# Altium project PCB_Project_Mini mobile robot.PrjPcb
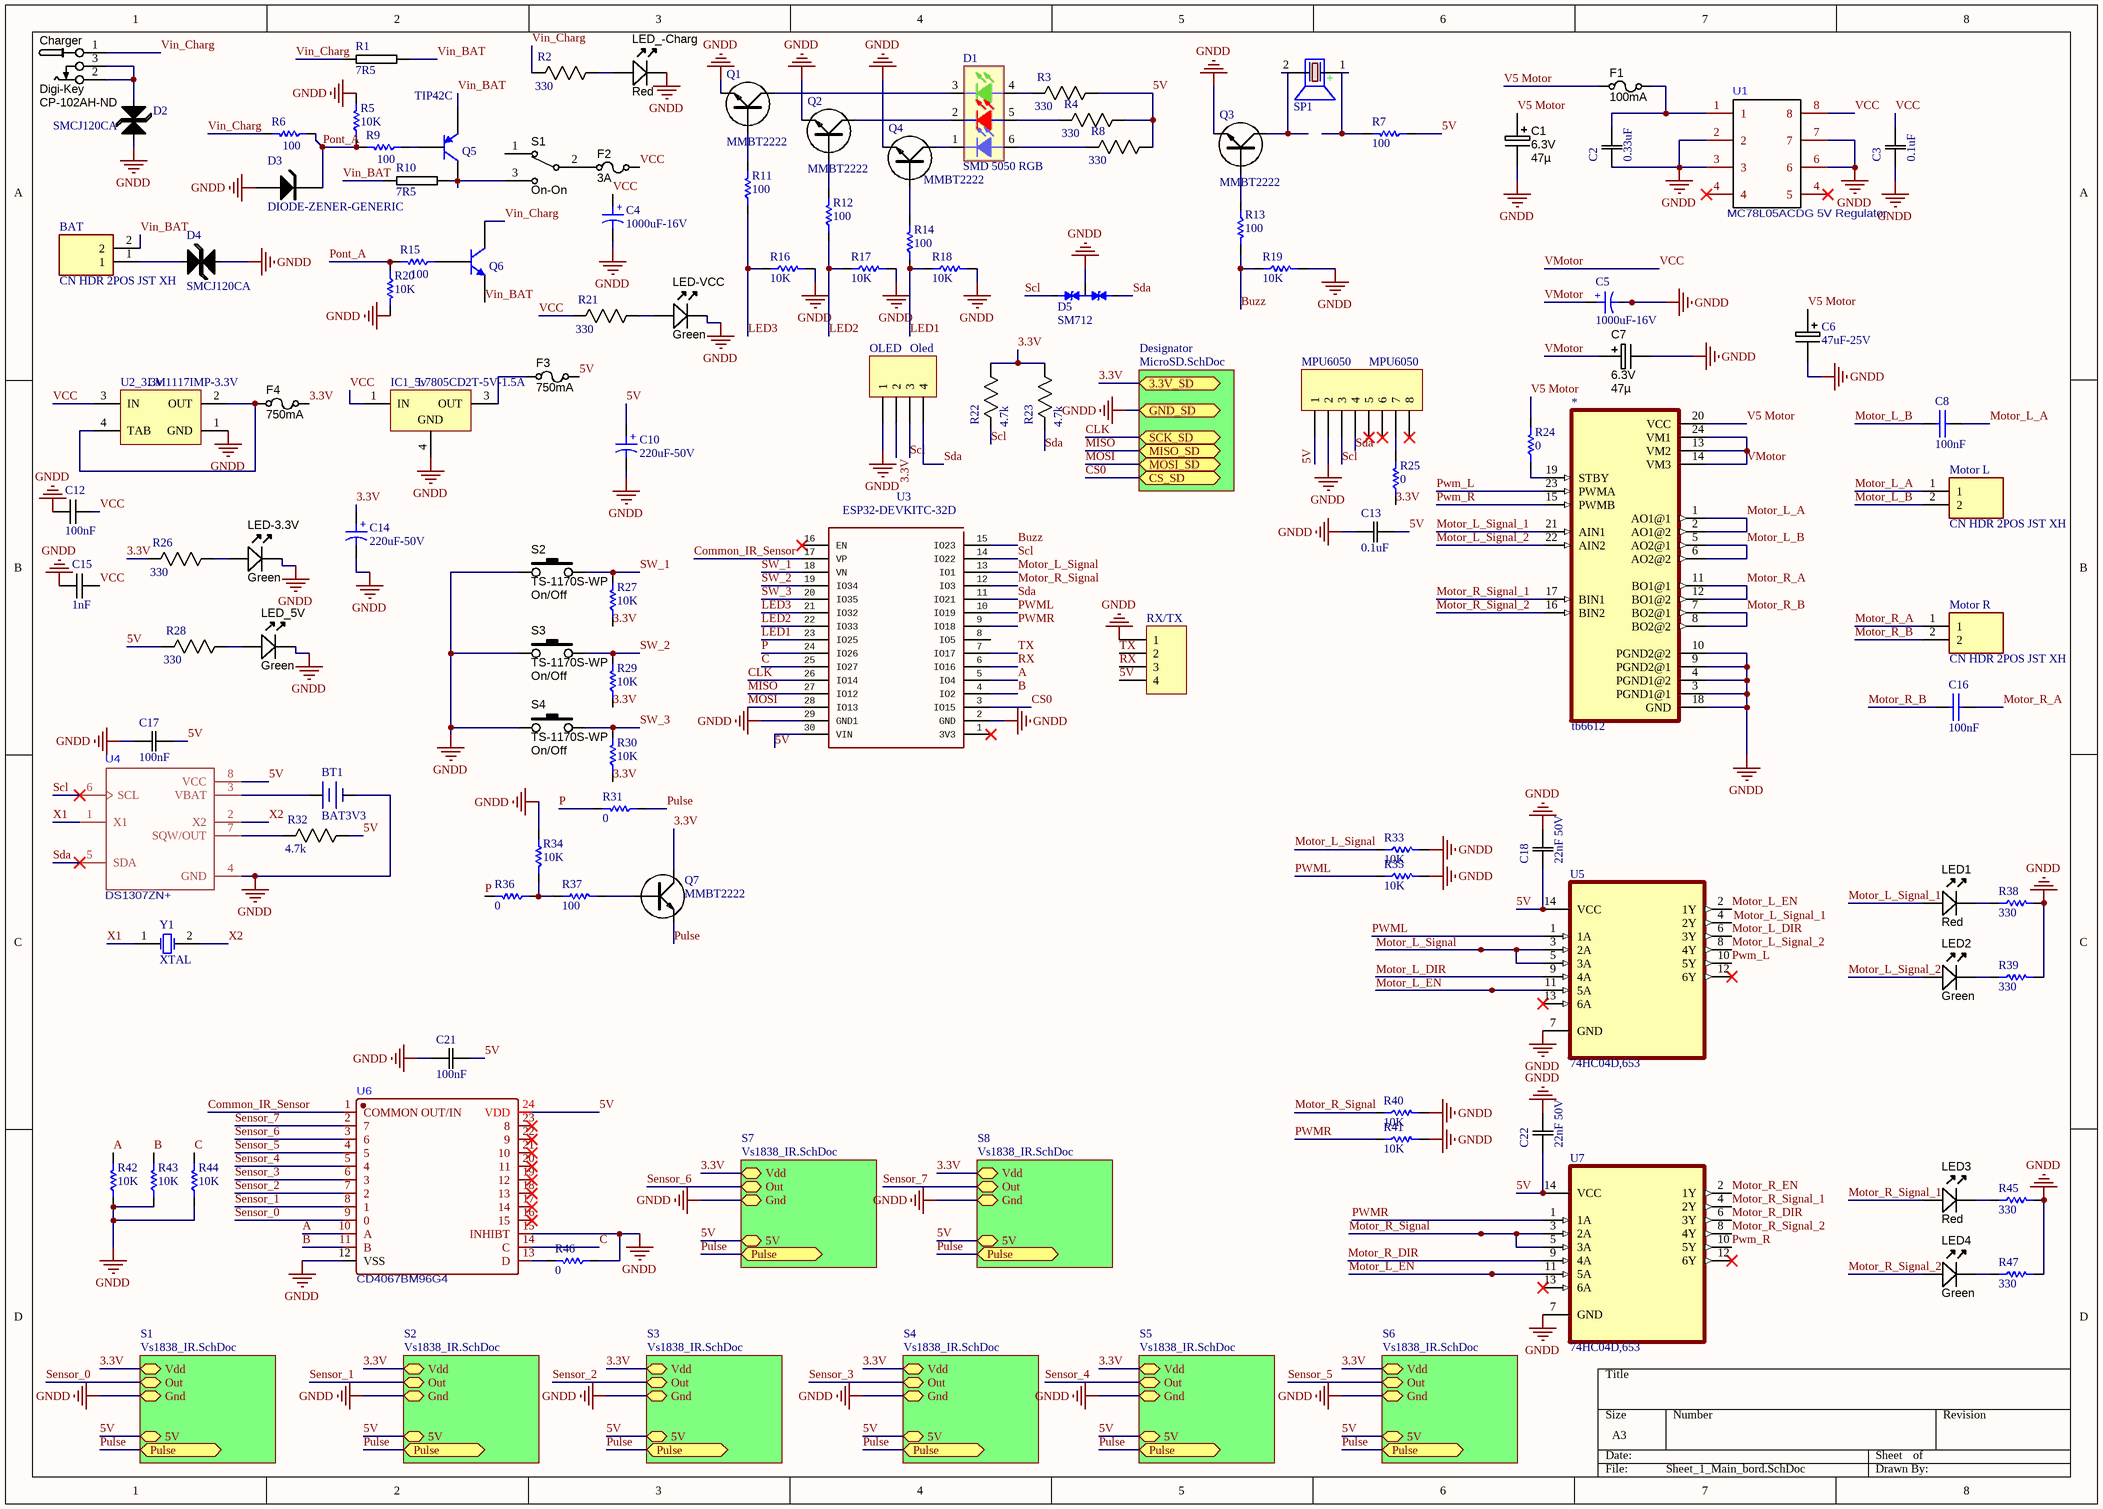
[diagram p0: Sheet_1_Main_bord.SchDoc]
3 sheets, 186 parts. Net scope: hierarchical (ports join the sheet entries above them; power ports are global).
Board file: Swarm.PcbDoc
Sheets:
  Sheet_1_Main_bord.SchDoc
    S1 = Vs1838_IR.SchDoc
    Designator = MicroSD.SchDoc
    S2 = Vs1838_IR.SchDoc
    S3 = Vs1838_IR.SchDoc
    S4 = Vs1838_IR.SchDoc
    S5 = Vs1838_IR.SchDoc
    S6 = Vs1838_IR.SchDoc
    S7 = Vs1838_IR.SchDoc
    S8 = Vs1838_IR.SchDoc

## Sheet Sheet_1_Main_bord.SchDoc
size A3; SheetNumber: 1; SheetTotal: 1

### Parts
*  tb6612  [Ssop24_SOP65P760X160-24N]
BAT  CN HDR 2POS JST XH  [JST_B2B-XH-A(LF)(SN)]
BT1  BAT3V3  [BTH1220]
C1  Ratings: 6.3V  [CAPMP3528X210N]  (hidden comment: 47µ)
C2  0.33uF  [0805]
C3  0.1uF  [0805]
C4  1000uF-16V  [CAP SMD 1000UF 16V]
C5  1000uF-16V  [CAP SMD 1000UF 16V]
C6  47uF-25V  [PANACAP-D-GENERIC]
C7  Ratings: 6.3V  [CAPMP3528X210N]  (hidden comment: 47µ)
C8  100nF  [Cap - 100nF - 2]
C10  220uF-50V  [CAP SMD 1000UF 16V]
C12  100nF  [1206C-GENERIC]
C13  0.1uF  [0805]
C14  220uF-50V  [CAP SMD 1000UF 16V]
C15  1nF  [1206C-GENERIC]
C16  100nF  [Cap - 100nF - 2]
C17  100nF  [0805]
C18  22nF 50V  [0805]
C21  100nF  [0805]
C22  22nF 50V  [0805]
Charger  Supplier 1: Digi-Key  Supplier Part Number 1: CP-102AH-ND  [CONN_PWR_JACK_2.1x5.5mm]  (hidden comment: CONN_PWR_JACK_2.1x5.5mm)
D1  Comment_1: SMD 5050 RGB  [5050 LED package]  (hidden comment: probably led colors not mach to real please check the device and change the component)
D2  SMCJ120CA  [DIODE-SMC]
D3  DIODE-ZENER-GENERIC  [SOT23-DIODE]
D4  SMCJ120CA  [DIODE-SMC]
D5  SM712  [PSM12___SOT23]
F1  value 100mA  [RESC3216X70N]  (hidden comment: Slow-blow)
F2  value 3A  [RESC3216X70N]  (hidden comment: Slow-blow)
F3  value 750mA  [RESC3216X70N]  (hidden comment: Slow-blow)
F4  value 750mA  [RESC3216X70N]  (hidden comment: Slow-blow)
IC1_5v  L7805CD2T-5V-1.5A  [TO-252]
LED1  Color: Red  [LED-0805-K]
LED2  Color: Green  [LED-0805-K]
LED3  Color: Red  [LED-0805-K]
LED4  Color: Green  [LED-0805-K]
LED-3.3V  Color: Green  [LED-0805-K]
LED-VCC  Color: Green  [LED-0805-K]
LED_5V  Color: Green  [LED-0805-K]
LED_-Charg  Color: Red  [LED-0805-K]
Motor_L  CN HDR 2POS JST XH  [JST_B2B-XH-A(LF)(SN)]
Motor_R  CN HDR 2POS JST XH  [JST_B2B-XH-A(LF)(SN)]
MPU6050  MPU6050  [HDR1X8]
OLED  Oled  [HDR1X4]
Q1  MMBT2222  [SOT23-BCE]
Q2  MMBT2222  [SOT23-BCE]
Q3  MMBT2222  [SOT23-BCE]
Q4  MMBT2222  [SOT23-BCE]
Q5  TIP42C  [TO-220 AB]
Q6  TIP41C  [TO-220 AB]  (value not drawn)
Q7  MMBT2222  [SOT23-BCE]
R1  7R5  [2512R-GENERIC]
R2  330  [0805]
R3  330  [0805]
R4  330  [0805]
R5  10K  [RES 0805 (2012X06L)]
R6  100  [RES 0805 (2012X06L)]
R7  100  [RES 0805 (2012X06L)]
R8  330  [0805]
R9  100  [RES 0805 (2012X06L)]
R10  7R5  [2512R-GENERIC]
R11  100  [RES 0805 (2012X06L)]
R12  100  [RES 0805 (2012X06L)]
R13  100  [RES 0805 (2012X06L)]
R14  100  [RES 0805 (2012X06L)]
R15  100  [RES 0805 (2012X06L)]
R16  10K  [RES 0805 (2012X06L)]
R17  10K  [RES 0805 (2012X06L)]
R18  10K  [RES 0805 (2012X06L)]
R19  10K  [RES 0805 (2012X06L)]
R20  10K  [RES 0805 (2012X06L)]
R21  330  [0805]
R22  4.7k  [0805]
R23  4.7k  [0805]
R24  0  [SMD_RES_0805]
R25  0  [SMD_RES_0805]
R26  330  [0805]
R27  10K  [RES 0805 (2012X06L)]
R28  330  [0805]
R29  10K  [RES 0805 (2012X06L)]
R30  10K  [RES 0805 (2012X06L)]
R31  0  [RES 0805 (2012X06L)]
R32  4.7k  [0805]
R33  10K  [RES 0805 (2012X06L)]
R34  10K  [RES 0805 (2012X06L)]
R35  10K  [RES 0805 (2012X06L)]
R36  0  [RES 0805 (2012X06L)]
R37  100  [RES 0805 (2012X06L)]
R38  330  [RES 0805 (2012X06L)]
R39  330  [RES 0805 (2012X06L)]
R40  10K  [RES 0805 (2012X06L)]
R41  10K  [RES 0805 (2012X06L)]
R42  10K  [RES 0805 (2012X06L)]
R43  10K  [RES 0805 (2012X06L)]
R44  10K  [RES 0805 (2012X06L)]
R45  330  [RES 0805 (2012X06L)]
R46  0  [RES 0805 (2012X06L)]
R47  330  [RES 0805 (2012X06L)]
RX/TX  (no value)  [HDR1X4]
S1  ON-ON  [SWITCH_SPDT_SLIDER]
S2  TS-1170S-WP  Function: On/Off  [TS-1170S]
S3  TS-1170S-WP  Function: On/Off  [TS-1170S]
S4  TS-1170S-WP  Function: On/Off  [TS-1170S]
SP1  (no value)  [BUZZER 7.62mm DC]
U1  MC78L05ACDG 5V Regulator  [78L05CD15V5V_LIB]
U2_3.3v  LM1117IMP-3.3V  [TO-252]
U3  ESP32-DEVKITC-32D  [MODULE_ESP32-DEVKITV1]
U4  DS1307ZN+  [SOIC-8]
U5  74HC04D,653  [SOIC127P600X175-14AN]
U6  CD4067BM96G4  [CD4067BM_SOIC-24]
U7  74HC04D,653  [SOIC127P600X175-14AN]
Y1  XTAL  [R38]

### Sub-sheets
Designator = MicroSD.SchDoc: no entries
S1 = Vs1838_IR.SchDoc: Vdd (bidir), Gnd (bidir), Out (bidir), 5V (bidir)
S2 = Vs1838_IR.SchDoc: Vdd (bidir), Gnd (bidir), Out (bidir), 5V (bidir)
S3 = Vs1838_IR.SchDoc: Vdd (bidir), Gnd (bidir), Out (bidir), 5V (bidir)
S4 = Vs1838_IR.SchDoc: Vdd (bidir), Gnd (bidir), Out (bidir), 5V (bidir)
S5 = Vs1838_IR.SchDoc: Vdd (bidir), Gnd (bidir), Out (bidir), 5V (bidir)
S6 = Vs1838_IR.SchDoc: Vdd (bidir), Gnd (bidir), Out (bidir), 5V (bidir)
S7 = Vs1838_IR.SchDoc: Vdd (bidir), Gnd (bidir), Out (bidir), 5V (bidir)
S8 = Vs1838_IR.SchDoc: Vdd (bidir), Gnd (bidir), Out (bidir), 5V (bidir)

### Ports
3.3V_SD (bidir), CS_SD (bidir), GND_SD (bidir), MISO_SD (bidir), MOSI_SD (bidir), Pulse (bidir), SCK_SD (bidir)

### Nets
GNDD: *.3(PGND1@1) *.4(PGND1@2) *.9(PGND2@1) *.10(PGND2@2) *.18(GND) BT1.2(-) C1.2 C2.1(C1) C3.1(C1) C4.2 C5.2 C6.- C7.2 C10.2 C12.2 C13.1(C1) C14.2 C15.2 C17.1(C1) C18.2(C2) C21.1(C1) C22.2(C2) D2.A D3.A D4.A D5.3 IC1_5v.4(GND) LED-3.3V.K LED-VCC.K LED_5V.K LED_-Charg.K MPU6050.2 OLED.1 Q1.E Q2.E Q3.E Q4.E R5.2 R16.2 R17.2 R18.2 R19.2 R20.2 R33.2 R34.2 R35.2 R38.2 R39.2 R40.2 R41.2 R42.1 R43.1 R44.1 R45.2 R46.1 R47.2 RX/TX.1 S2.1 S3.1 S4.1 U1.2 U1.3 U1.6 U1.7 U2_3.3v.1(GND) U3.2(GND) U3.29(GND1) U4.4(GND) U5.7(GND) U6.12(VSS) U6.15(INHIBT) U7.7(GND) ; port GND_SD, sheet S1/Gnd, sheet S2/Gnd, sheet S3/Gnd, sheet S4/Gnd, sheet S5/Gnd, sheet S6/Gnd, sheet S7/Gnd, sheet S8/Gnd  [project net GND]
3.3V: C14.1 F4.1 OLED.2 Q7.C R22.1(R1) R23.1(R1) R25.1 R26.2(R2) R27.1 R29.1 R30.1 ; port 3.3V_SD, sheet S1/Vdd, sheet S2/Vdd, sheet S3/Vdd, sheet S4/Vdd, sheet S5/Vdd, sheet S6/Vdd, sheet S7/Vdd, sheet S8/Vdd
5V: C10.1 C13.2(C2) C17.2(C2) C18.1(C1) C21.2(C2) C22.1(C1) F3.1 MPU6050.1 R3.1(R1) R4.1(R1) R7.1 R8.1(R1) R28.2(R2) R32.1(R1) RX/TX.4 U3.30(VIN) U4.8(VCC) U5.14(VCC) U6.24(VDD) U7.14(VCC) ; sheet S1/5V, sheet S2/5V, sheet S3/5V, sheet S4/5V, sheet S5/5V, sheet S6/5V, sheet S7/5V, sheet S8/5V
A: R42.2 U3.5(IO4) U6.10(A)
B: R43.2 U3.4(IO2) U6.11(B)
Buzz: R13.2 R19.1 U3.15(IO23)
C: R44.2 U3.25(IO27) U6.14(C)
CLK: U3.26(IO14) ; port SCK_SD
Common_IR_Sensor: U3.17(VP) U6.1(COMMON_OUT/IN)
CS0: U3.3(IO15) ; port CS_SD
LED1: R14.1 R18.1 U3.23(IO25)
LED2: R12.1 R17.1 U3.22(IO33)
LED3: R11.1 R16.1 U3.21(IO32)
MISO: U3.27(IO12) ; port MISO_SD
MOSI: U3.28(IO13) ; port MOSI_SD
Motor_L_A: *.1(AO1@1) *.2(AO1@2) C8.2(-) Motor_L.1
Motor_L_B: *.5(AO2@1) *.6(AO2@2) C8.1(+) Motor_L.2
Motor_L_DIR: U5.6(3Y) U5.9(4A)
Motor_L_EN: U5.2(1Y) U5.11(5A) U7.11(5A)
Motor_L_Signal: R33.1 U3.13(IO1) U5.3(2A) U5.5(3A)
Motor_L_Signal_1: *.21(AIN1) LED1.A
Motor_L_Signal_2: *.22(AIN2) LED2.A U5.8(4Y)
Motor_R_A: *.11(BO1@1) *.12(BO1@2) C16.2(-) Motor_R.1
Motor_R_B: *.7(BO2@1) *.8(BO2@2) C16.1(+) Motor_R.2
Motor_R_DIR: U7.6(3Y) U7.9(4A)
Motor_R_EN: U7.2(1Y)
Motor_R_Signal: R40.1 U3.12(IO3) U7.3(2A) U7.5(3A)
Motor_R_Signal_1: *.17(BIN1) LED3.A U7.4(2Y)
Motor_R_Signal_2: *.16(BIN2) LED4.A U7.8(4Y)
P: R31.2 R36.2 U3.24(IO26)
Pont_A: D3.K R5.1 R6.1 R9.2 R15.2 R20.1
Pulse: Q7.E R31.1 ; port Pulse
Pwm_L: *.23(PWMA) U5.10(5Y)
Pwm_R: *.15(PWMB) U7.10(5Y)
PWML: R35.1 U3.10(IO19) U5.1(1A)
PWMR: R41.1 U3.9(IO18) U7.1(1A)
RX: RX/TX.3 U3.6(IO16)
Scl: D5.1 MPU6050.3 OLED.3 R22.2(R2) U3.14(IO22) U4.6(SCL)
Sda: D5.2 MPU6050.4 OLED.4 R23.2(R2) U3.11(IO21) U4.5(SDA)
Sensor_0: U6.9(0) ; sheet S1/Out
Sensor_1: U6.8(1) ; sheet S2/Out
Sensor_2: U6.7(2) ; sheet S3/Out
Sensor_3: U6.6(3) ; sheet S4/Out
Sensor_4: U6.5(4) ; sheet S5/Out
Sensor_5: U6.4(5) ; sheet S6/Out
Sensor_6: U6.3(6) ; sheet S7/Out
Sensor_7: U6.2(7) ; sheet S8/Out
SW_1: R27.2 S2.2 U3.18(VN)
SW_2: R29.2 S3.2 U3.19(IO34)
SW_3: R30.2 S4.2 U3.20(IO35)
TX: RX/TX.2 U3.7(IO17)
V5 Motor: *.20(VCC) C1.1 C6.+ F1.2 R24.2
VCC: *.13(VM2) *.14(VM3) *.24(VM1) C3.2(C2) C4.1 C5.1 C7.1 C12.1 C15.1 F2.1 IC1_5v.1(IN) R21.2(R2) U1.8 U2_3.3v.3(IN)  [also labelled VMotor]
Vin_BAT: BAT.2 Q5.3(E) Q6.3(E) R1.2 R10.1
Vin_Charg: Charger.1 Q6.2(C) R1.1 R2.2(R2) R6.2
X1: U4.1(X1) Y1.1(OSC1)
X2: U4.2(X2) Y1.2(OSC2)
Net*_19: *.19(STBY) R24.1
NetBAT_1: BAT.1 D4.K
NetBT1_1: BT1.1(+) U4.3(VBAT)
NetC2_2: C2.2(C2) F1.1 U1.1
NetCharger_2: Charger.2 Charger.3 D2.K
NetD1_1: D1.1 Q4.C
NetD1_2: D1.2 Q2.C
NetD1_3: D1.3 Q1.C
NetD1_4: D1.4 R3.2(R2)
NetD1_5: D1.5 R4.2(R2)
NetD1_6: D1.6 R8.2(R2)
NetF2_2: F2.2 S1.2
NetF3_2: F3.2 IC1_5v.3(OUT)
NetF4_2: F4.2 U2_3.3v.2(OUT) U2_3.3v.4(TAB)
NetLED1_K: LED1.K R38.1
NetLED2_K: LED2.K R39.1
NetLED3_K: LED3.K R45.1
NetLED4_K: LED4.K R47.1
NetLED-3.3V_A: LED-3.3V.A R26.1(R1)
NetLED-VCC_A: LED-VCC.A R21.1(R1)
NetLED_5V_A: LED_5V.A R28.1(R1)
NetLED_-Charg_A: LED_-Charg.A R2.1(R1)
NetMPU6050_7: MPU6050.7 R25.2
NetQ1_B: Q1.B R11.2
NetQ2_B: Q2.B R12.2
NetQ3_B: Q3.B R13.1
NetQ3_C: Q3.C SP1.2(-)
NetQ4_B: Q4.B R14.2
NetQ5_1: Q5.1(B) R9.1
NetQ5_2: Q5.2(C) R10.2 S1.3
NetQ6_1: Q6.1(B) R15.1
NetQ7_B: Q7.B R37.1
NetR7_2: R7.2 SP1.1(+)
NetR32_2: R32.2(R2) U4.7(SQW/OUT)
NetR34_1: R34.1 R36.1 R37.2
NetR46_2: R46.2 U6.13(D)

Not connected (* = marked no-connect by the designer): MPU6050 5* 6* 8*; S1 1; U1 4*; U3 1(3V3)* 8(IO5) 16(EN)*; U5 4(2Y) 12(6Y)* 13(6A)*; U6 16(15)* 17(14)* 18(13)* 19(12)* 20(11)* 21(10)* 22(9)* 23(8)*; U7 12(6Y)* 13(6A)*

### Notes on the sheet
- Labels drawn without touching a wire or pin: Motor_L_Signal_1
- (in symbol Cap ELECTROLITIC TOTAL SIZE) +

### Library data of the parts
BAT Motor_L Motor_R = CN HDR 2POS JST XH: Connector Header Through Hole 2 position 0.098 _2.50mm_ / JST XH; MP: B2B-XH-A_LF__SN_; MF: JST Sales; Price: None; Package: None; Value: *; Availability: Unavailable; SnapEDA_Link: https://www.snapeda.com/parts/B2B-XH-A%28LF%29%28SN%29/JST%20Sales%20America%20Inc./view-part/492310/?ref=snap
BT1 = Battry Backup: Designer: Abbas Basereh; Data: 16-12-2016; Link: *; Part. No: *
C1 C7 = CAPT_47u_1210_6V3: Capacitor SMD Tantalum 47uF 20% 6.3V 1210; Manufacturer 1: AVX Corporation; Manufacturer Part Number 1: TCJB476M006R0070; Manufacturer Size Code: B; Voltage - Rated: 6V3; ESR (Equivalent Series Resistance): 70.0 mOhm; Type: Molded; SCDType: spec; Package / Case: 1210 (3528 Metric); Tolerance: ±20%; Material: Tantalum; Supplier 1: Digi-Key; Supplier Part Number 1: 478-3139-1-ND; Operating Temperature: -55°C ~ 125°C; Size / Dimension: 0.138" L x 0.110" W (3.50mm x 2.80mm); Height - Seated (Max): 0.083" (2.10mm); ComponentLink1URL: http://www.avx.com/docs/Catalogs/tcj.pdf; ComponentLink1Description: http://www.avx.com/docs/Catalogs/tcj.pdf; Value: 47µ
C2 C3 C13 C17 C18 C21 C22 = CAP 470nF 50V: CAP CER 0.1UF 50V X7R 0805; Value: 470nF; Tolerance: 10%; Package: 0805; Rating: 50V
C4 C5 C10 C14 = Cap ELECTROLITIC TOTAL SIZE: Cap electrolitic radial; Designer: Abbas Basereh; Data: 16-12-2016; Part. No: *
  C4 C5: VALUE: 1000uF-16V
  C10 C14: VALUE: 220uF-50V
C6 = PANACAP-47UF-25V-FK: GENERIC CAPACITOR POLARISED; Supplier 1: Digi-Key; Supplier Part Number 1: PCE3804TR-ND
C8 C16 = Cap-Bipolar: Bipolar Capacitor; Voltage: 100V; Designer: Saeid Jorablo; Organazation: ControTec; Adding Date: 1387/12/20; Value: 100nF
C12 C15 = 1206C-2U2-50V: CAPACITOR 0603 CERAMIC; REEL: C100; Supplier 1: Digi-Key; Supplier Part Number 1: 490-4796-2-ND
Charger = CONN_PWR_JACK_2.1x5.5mm: Power Connector, THT, 2.1mm ID, 5.5mm OD; Manufacturer 1: CUI Inc; Manufacturer Part Number 1: PJ-102AH; SCDType: undef; Category: Connectors; Mounting Type: Through Hole; Package / Case: PCB mount; Value: 2.1mm ID, 5.5mm OD
D1 = LED SMD 5050 RGB: SMD 5050 RGB LED; Designer: Abbas Basereh; Design Date: 1395/11/10; ComponentLink1Description: SMD 5050 RGB; ComponentLink1URL: http://www.yuanlei-led.com; ComponentLink2Description: Reference; PackageDescription: SMD 5050 RGB; Publisher: Abbas Basereh; Mounting Technology: Surface Mount; HelpURL: probably color of the leds not mached real please check and change; Pin Count: 6; Status: Unreleased
D2 D4 = SMCJ120CA: Transient Surpression Diode TVS; Supplier 1: Digi-Key; Supplier Part Number 1: SMCJ120CABTR-ND
D3 = DIODE-ZENER-GENERIC: GENERIC ZENER DIODE
D5 = SM712.TC: Asymmetrical TVS Diode for  Extended Common-Mode RS-485; Manufacturer: SEMTECH; Link to Datasheet: *; Link to Picture: *; Operating Temp: -55 to 125 °C; Storage Temp: -55 to 150 °C; ComponentLink1Description: *; ComponentLink1URL: *; Manufacture Part #: SM712.TC; Value: SM712
F1-F4 = FUSE_160mA_1206: Fuse 160mA 63VDC 1206 SMD; Manufacturer 1: Holly Fuse; Manufacturer Part Number 1: 12T-0160L; Ratings: 160mA; 63VDC; slow-blow; SCDType: spec; Package / Case: 1206 (3216 metric)
IC1_5v = L78M05: Precision 500mA Regulator
LED1 LED3 = LED_SMD_Red_0805_6mcd: LED 0805 SMD Red 6mcd 621nm; Manufacturer 1: Lite-On Inc; Manufacturer Part Number 1: LTST-C171EKT; Material: GaAsP on GaP; Ratings: 6 mcd; 621 nm; SCDType: source; Package / Case: 0805; Supplier 1: Digi-Key; Supplier Part Number 1: 160-1422-1-ND; Value: Red
LED2 LED4 = LED_SMD_Green_0805_6mcd: LED, 0805 SMD, Green; Manufacturer 1: LITE-ON; Manufacturer Part Number 1: LTST-C171GKT; Material: GaP; Ratings: 6 mcd; 569 nm; SCDType: source; Package / Case: 0805; Supplier 1: Digi-Key; Supplier Part Number 1: 160-1423-1-ND; Value: Green
LED-3.3V LED-VCC LED_5V = LED_SMD_Green_0805_6mcd: LED, 0805 SMD, Green; Manufacturer 1: LITE-ON; Manufacturer Part Number 1: LTST-C171GKT; Ratings: 6 mcd; 569 nm; SCDType: source; Package / Case: 0805; Material: GaP; Supplier 1: Digi-Key; Supplier Part Number 1: 160-1423-1-ND; Value: Green
LED_-Charg = LED_SMD_Red_0805_6mcd: LED 0805 SMD Red 6mcd 621nm; Manufacturer 1: Lite-On Inc; Manufacturer Part Number 1: LTST-C171EKT; Ratings: 6 mcd; 621 nm; SCDType: source; Package / Case: 0805; Material: GaAsP on GaP; Supplier 1: Digi-Key; Supplier Part Number 1: 160-1422-1-ND; Value: Red
MPU6050 = Header 8: Header, 8-Pin; LatestRevisionDate: 17-Jul-2002; LatestRevisionNote: Re-released for DXP Platform.; Publisher: Altium Limited
OLED RX/TX = Header 4: Header, 4-Pin; LatestRevisionDate: 17-Jul-2002; LatestRevisionNote: Re-released for DXP Platform.; Publisher: Altium Limited
Q1-Q4 Q7 = MMBT2222: BC847 SMALL SIGNAL NPN TRANSISTOR; Supplier 1: Digi-Key; Supplier Part Number 1: MMBT2222A-FDICT-ND
Q5 = TIP42C: PNP  power transistor; Manufacturer: STMicroelectronics; Designer: Abbas Basereh; DESC.: Complementary power transistors; Link: https://www.aliexpress.com/item/; Link: http://www.tme.eu/en/; Link: http://www.digikey.com/; Part. No: TIP42C
Q6 = TIP41C: NPN  power transistor; Manufacturer: STMicroelectronics; Designer: Abbas Basereh; DESC.: Complementary power transistors; Link: https://www.aliexpress.com/item/; Link: http://www.tme.eu/en/; Link: http://www.digikey.com/; Part. No: TIP41C
R1 R10 = 2512R-7R5: GENERIC RESISTOR 2512; Manufacturer Part Number: CRCW25127R50JNEG; Manufacturer: Vishay/Dale; REEL: R20; Supplier 1: Digi-Key; Supplier Part Number 1: 541-7.5XDKR-ND
R2 = RES 1k 1/8W - 1%: RES SMD 1K OHM 1% 1/8W 0603/0805; Power (Watts): 0.125W; Package: 0805; Value: 1k; Tolerance: 1%
R3 R4 R8 R21 R26 R28 = RES 330.0 1/8W - 1%: RES SMD 330 OHM 1% 1/8W 0805; Rating: 0.125W; Package: 0805; Value: 330; Tolerance: 1%
R5-R7 R9 R11-R20 R24 R25 R27 R29-R31 R33-R47 = Resistor: Tolerance: 5%; Power: 1/8 W
  R5 R16-R20 R27 R29 R30 R33-R35 R40-R44: Value: 10K
  R6 R7 R9 R11-R15 R37: Value: 100
  R24 R25 R31 R36 R46: Value: 0
  R38 R39 R45 R47: Value: 330
R22 R23 R32 = RES 4.7k 1/8W - 5%: RES SMD 4.7k OHM 5% 1/8W 0805; Power (Watts): 0.125W; Package: 0805; Value: 4.7k; Tolerance: 5%
S1 = SW_THD_SPDT_On-On: Switch THD vertical toggle SPDT; Manufacturer 1: TE Connectivity; Manufacturer Part Number 1: SLS121PC04; Contact Rating @ Voltage: 0.25A @ 125VAC; SCDType: spec; Circuit: SPDT; Mounting Type: PCB mount; Supplier 1: Digi-Key; Supplier Part Number 1: 450-1598-ND; Switch Function: On-On
S2-S4 = SW_SMD_PB_7.0mm: Switch SMD Tact 7.0mm Stem; Manufacturer 1: Bond-Tact; Manufacturer Part Number 1: TS-1170S-WP-200; SCDType: source; Package / Case: 6.5x6.5mm; 7.0mm stem; ComponentLink1URL: http://www.bondtact.com.hk/zaspx/productd.aspx?catno=3&subcatid=3&PageNo=2&productno=40; ComponentLink1Description: http://www.bondtact.com.hk/zaspx/productd.aspx?catno=3&subcatid=3&PageNo=2&productno=40
SP1 = PIEZO BUZZER: PIEZO BUZZER ACTIVE; Designer: Abbas Basereh; Comment_1: SPEAKER AND BEEP; Design Date: 1395/11/14; ComponentLink2Description: Reference; PackageDescription: THD; Publisher: Abbas Basereh; Mounting Technology: THD; Pin Count: 2; Status: Unreleased
U2_3.3v = LM1117IMP-x.x: x.x Volt, 800mA Low-Dropout Linear Regulator, 4-pin SOT-223; pin to pad: 2>4; Manufacturer: National Semiconductor; PackageTopMarking: XYTT*N05B; PowerWise: N; CompType: LDO IC; Published: 4-Dec-2008; DatasheetVersion: Apr-2006; PackageVersion: revB, Apr-2003; PackageReference: MP04A; Publisher: Altium Limited; PackageDescription: Molded SOT-223, 6.50 x 3.56 x 1.6mm Body, 4 Lead, 2.3mm Pitch; Supplier 1: Farnell; Supplier Part Number 1: 7614123; PartNumber: LM1117IMP-3.3; RoHS: N; PinCount: 4; Code_JEDEC: TO-261-AA; Code_IPC: SOT223-4; ComponentLink1Description: LM1117 Datasheet; ComponentLink1URL: http://www.national.com/ds/LM/LM1117.pdf; ComponentLink2Description: LM1117 Web Page; ComponentLink2URL: http://www.national.com/pf/LM/LM1117.html; ComponentLink3Description: MP04A Package Page; ComponentLink3URL: http://www.national.com/packaging/folders/mp04a.html
U3 = ESP32-DEVKITC-32D: Eval Board For Esp-Wroom-32; MF: Espressif Systems; Availability: Unavailable; Package: None; SnapEDA_Link: https://www.snapeda.com/parts/ESP32-DEVKITC-32D/Espressif%20Systems/view-part/?ref=snap; MP: ESP32-DEVKITC-32D; Price: None; Value: *
U5 U7 = 74HC04D,653: Inverter IC 6 Channel 14-SO; MF: Nexperia USA; Price: None; Availability: Good; Package: SO14-14 Nexperia USA Inc.; MP: 74HC04D,653; Value: *; SnapEDA_Link: https://www.snapeda.com/parts/74HC04D,653/Nexperia/view-part/1784153/?ref=snap; Purchase-URL: https://pricing.snapeda.com/search/part/74HC04D,653/?ref=eda; Check_prices: https://www.snapeda.com/parts/74HC04D,653/Nexperia/view-part/1784153/?ref=eda
Y1 = XTAL: Crystal Oscillator; Published: 8-Jun-2000; LatestRevisionDate: 17-Jul-2002; LatestRevisionNote: Re-released for DXP Platform.; PackageReference: R38; Publisher: Altium Limited; PackageDescription: Crystal, Thru-Hole; 2 Leads; Body 3.1 x 8.2 mm (Dia.xH)

## Sheet Vs1838_IR.SchDoc
size B
Used 8 times, as channels S1, S2, S3, S4, S5, S6, S7, S8. Parts and nets are listed once, with the designators drawn on the sheet.
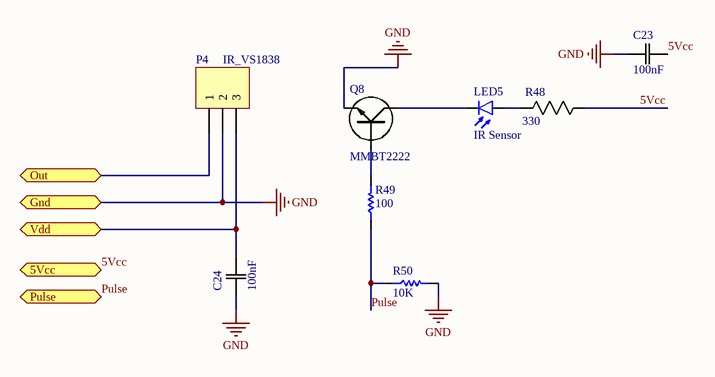
[diagram p1: Vs1838_IR.SchDoc]

### Parts
C23  100nF  [0805]
C24  100nF  [0805]
LED5  IR Sensor  [LED5mm_IR]
P4  IR_VS1838  [HDR1X3]
Q8  MMBT2222  [SOT23-BCE]
R48  330  [0805]
R49  100  [RES 0805 (2012X06L)]
R50  10K  [RES 0805 (2012X06L)]

### Ports
5Vcc (bidir), Gnd (bidir), Out (bidir), Pulse (bidir), Vdd (bidir)

### Nets
GND: C23.1(C1) C24.1(C1) P4.2 Q8.E R50.2 ; port Gnd
5Vcc: C23.2(C2) R48.1(R1) ; port 5Vcc
Out: P4.1 ; port Out
Pulse: R49.1 R50.1 ; port Pulse
Vdd: C24.2(C2) P4.3 ; port Vdd
NetLED5_1: LED5.1(A) R48.2(R2)
NetLED5_2: LED5.2(K) Q8.C
NetQ8_B: Q8.B R49.2

### Channels
S1: designators end in _S1; ports 5Vcc=5Vcc_S1 Gnd=GND Out=Sensor_0 Pulse=Pulse_S1 Vdd=3.3V
S2: designators end in _S2; ports 5Vcc=5Vcc_S2 Gnd=GND Out=Sensor_1 Pulse=Pulse_S2 Vdd=3.3V
S3: designators end in _S3; ports 5Vcc=5Vcc_S3 Gnd=GND Out=Sensor_2 Pulse=Pulse_S3 Vdd=3.3V
S4: designators end in _S4; ports 5Vcc=5Vcc_S4 Gnd=GND Out=Sensor_3 Pulse=Pulse_S4 Vdd=3.3V
S5: designators end in _S5; ports 5Vcc=5Vcc_S5 Gnd=GND Out=Sensor_4 Pulse=Pulse_S5 Vdd=3.3V
S6: designators end in _S6; ports 5Vcc=5Vcc_S6 Gnd=GND Out=Sensor_5 Pulse=Pulse_S6 Vdd=3.3V
S7: designators end in _S7; ports 5Vcc=5Vcc_S7 Gnd=GND Out=Sensor_6 Pulse=Pulse_S7 Vdd=3.3V
S8: designators end in _S8; ports 5Vcc=5Vcc_S8 Gnd=GND Out=Sensor_7 Pulse=Pulse_S8 Vdd=3.3V

### Library data of the parts
C23 C24 = CAP 470nF 50V: as C2 on sheet Sheet_1_Main_bord; Package: 0805; Rating: 50V
LED5 = LED IR: Infra Red Reciever Photo Diode; Designer: Saeid Jorablo; Organazation: ControTec; Adding Date: 1387/12/22
P4 = Header 3: Header, 3-Pin; LatestRevisionDate: 17-Jul-2002; LatestRevisionNote: Re-released for DXP Platform.; Publisher: Altium Limited
Q8 = MMBT2222: BC847 SMALL SIGNAL NPN TRANSISTOR; Supplier 1: Digi-Key; Supplier Part Number 1: MMBT2222A-FDICT-ND
R48 = RES 330.0 1/8W - 1%: as R3 on sheet Sheet_1_Main_bord; Package: 0805; Value: 330; Tolerance: 1%
R49 R50 = Resistor: Tolerance: 5%; Power: 1/8 W
  R49: Value: 100
  R50: Value: 10K

## Sheet MicroSD.SchDoc
size B
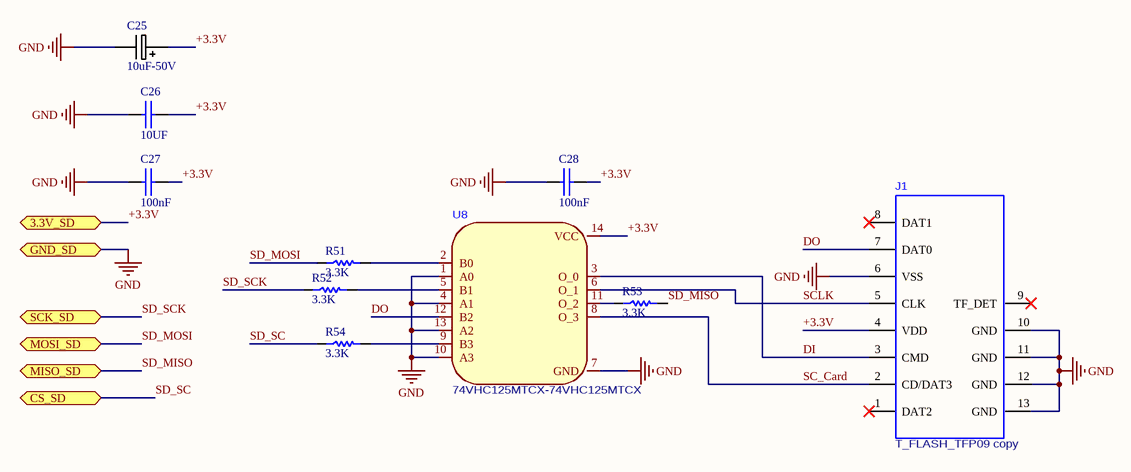
[diagram p2: MicroSD.SchDoc]

### Parts
C25  10uF-50V  [PANACAP-D-GENERIC]
C26  10UF  [SMD_CAP_0805]
C27  100nF  [SMD_CAP_0805]
C28  100nF  [SMD_CAP_0805]
J1  T_FLASH_TFP09 copy  [TFP09-2-12B-MOD]
R51  3.3K  [RES 0805 (2012X06L)]
R52  3.3K  [RES 0805 (2012X06L)]
R53  3.3K  [RES 0805 (2012X06L)]
R54  3.3K  [RES 0805 (2012X06L)]
U8  74VHC125MTCX-74VHC125MTCX  [SOP65P640X120-14N]

### Ports
3.3V_SD (bidir), CS_SD (bidir), GND_SD (bidir), MISO_SD (bidir), MOSI_SD (bidir), SCK_SD (bidir)

### Nets
GND: C25.- C26.1(+) C27.1(+) C28.1(+) J1.6(VSS) J1.10(GND) J1.11(GND) J1.12(GND) J1.13(GND) U8.1(A0) U8.4(A1) U8.7(GND) U8.10(A3) U8.13(A2) ; port GND_SD
+3.3V: C25.+ C26.2(-) C27.2(-) C28.2(-) J1.4(VDD) U8.14(VCC) ; port 3.3V_SD
DI: J1.3(CMD) U8.3(O_0)
DO: J1.7(DAT0) U8.12(B2)
SC_Card: J1.2(CD/DAT3) U8.8(O_3)
SCLK: J1.5(CLK) U8.6(O_1)
SD_MISO: R53.2 ; port MISO_SD
SD_MOSI: R51.1 ; port MOSI_SD
SD_SC: R54.1 ; port CS_SD
SD_SCK: R52.1 ; port SCK_SD
NetR51_2: R51.2 U8.2(B0)
NetR52_2: R52.2 U8.5(B1)
NetR53_1: R53.1 U8.11(O_2)
NetR54_2: R54.2 U8.9(B3)

Not connected (* = marked no-connect by the designer): J1 1(DAT2)* 8(DAT1)* 9(TF_DET)*

### Library data of the parts
C25 = PANACAP-10UF-50V-FK: GENERIC CAPACITOR POLARISED; Supplier 1: Digi-Key; Supplier Part Number 1: PCE3807TR-ND
C26-C28 = Cap-Bipolar: as C8 on sheet Sheet_1_Main_bord; Adding Date: 1387/12/20
  C26: Value: 10UF
  C27 C28: Value: 100nF
R51-R54 = Resistor: Tolerance: 5%; Power: 1/8 W; Value: 3.3K

## Nets that join several sheets
GND: Sheet_1_Main_bord (72 pins), S1 (5 pins), MicroSD (14 pins), S2 (5 pins), S3 (5 pins), S4 (5 pins), S5 (5 pins), S6 (5 pins), S7 (5 pins), S8 (5 pins)
3.3V: Sheet_1_Main_bord (11 pins), S1 (C24_S1.2 P4_S1.3), S2 (C24_S2.2 P4_S2.3), S3 (C24_S3.2 P4_S3.3), S4 (C24_S4.2 P4_S4.3), S5 (C24_S5.2 P4_S5.3), S6 (C24_S6.2 P4_S6.3), S7 (C24_S7.2 P4_S7.3), S8 (C24_S8.2 P4_S8.3)
Sensor_0: Sheet_1_Main_bord (U6.9), S1 (P4_S1.1)
Sensor_1: Sheet_1_Main_bord (U6.8), S2 (P4_S2.1)
Sensor_2: Sheet_1_Main_bord (U6.7), S3 (P4_S3.1)
Sensor_3: Sheet_1_Main_bord (U6.6), S4 (P4_S4.1)
Sensor_4: Sheet_1_Main_bord (U6.5), S5 (P4_S5.1)
Sensor_5: Sheet_1_Main_bord (U6.4), S6 (P4_S6.1)
Sensor_6: Sheet_1_Main_bord (U6.3), S7 (P4_S7.1)
Sensor_7: Sheet_1_Main_bord (U6.2), S8 (P4_S8.1)